# Altium schematic sheet p1_title_toc.SchDoc
size OrCAD B; DocumentNumber: 1; SheetNumber: 1; SheetTotal: 3
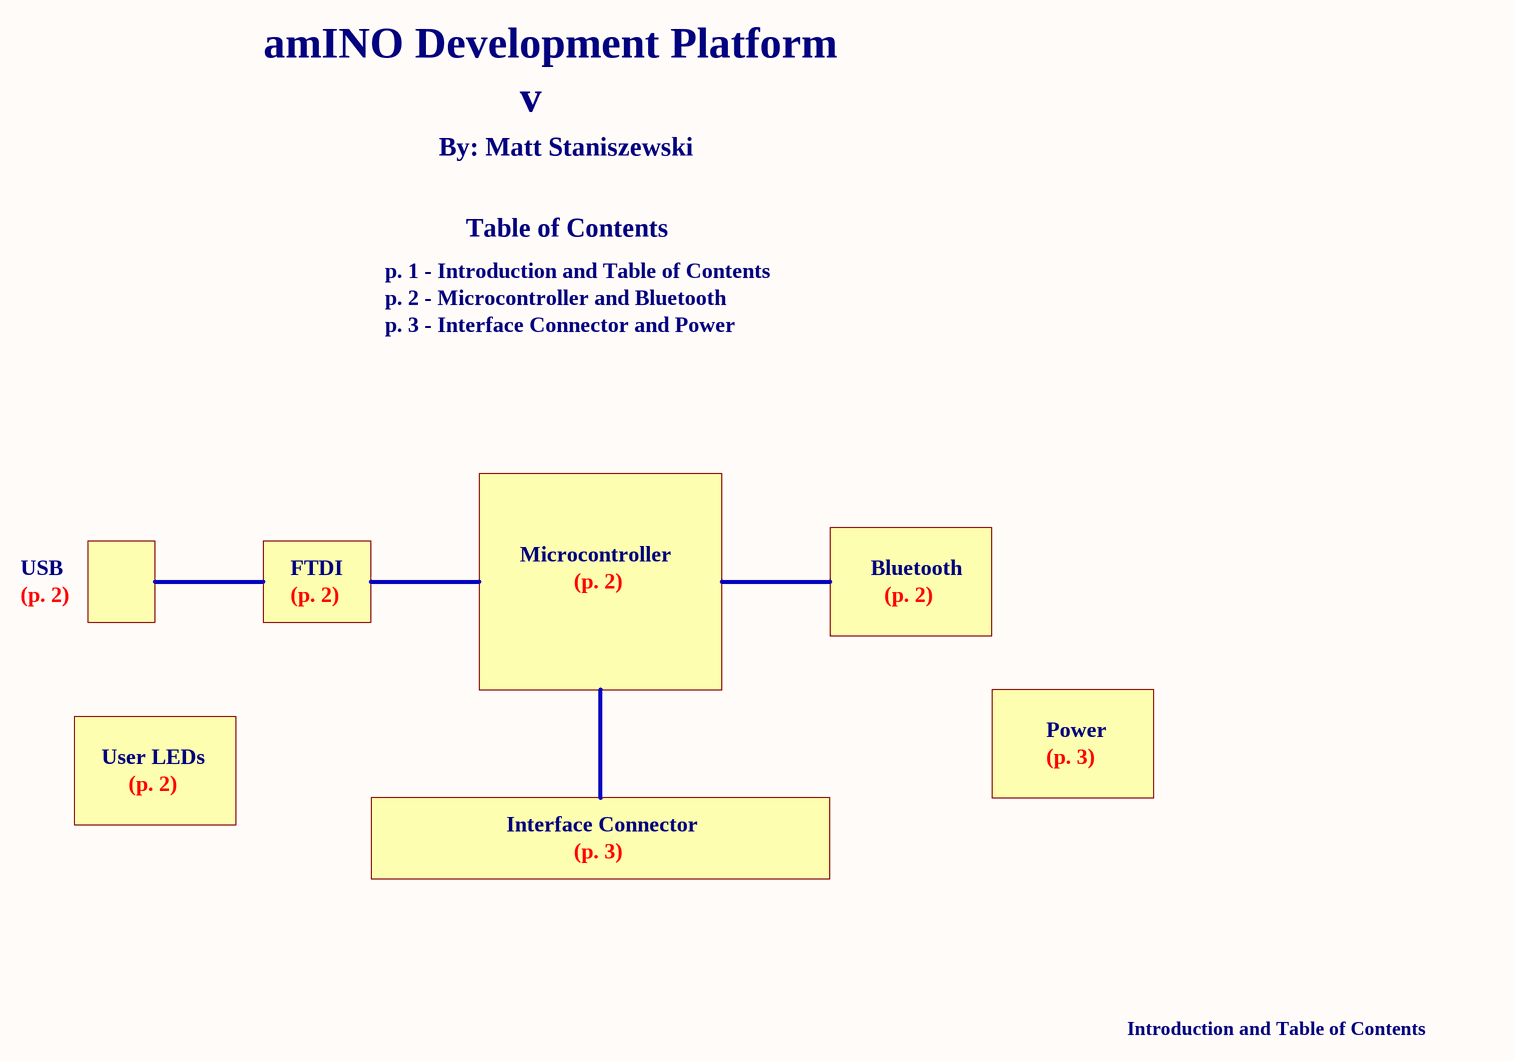
[diagram p0: p1_title_toc.SchDoc]

## Notes on the sheet
- amINO Development Platform
- By: Matt Staniszewski
- v
- p. 1 - Introduction and Table of Contents
- Table of Contents
- p. 2 - Microcontroller and Bluetooth
- p. 3 - Interface Connector and Power
- Microcontroller
- USB
- (p. 2)
- FTDI
- Bluetooth
- User LEDs
- Power
- (p. 3)
- Interface Connector
- Introduction and Table of Contents